# EAGLE design CH340C_USB-C_v1_complete (EAGLE 9.6.2)
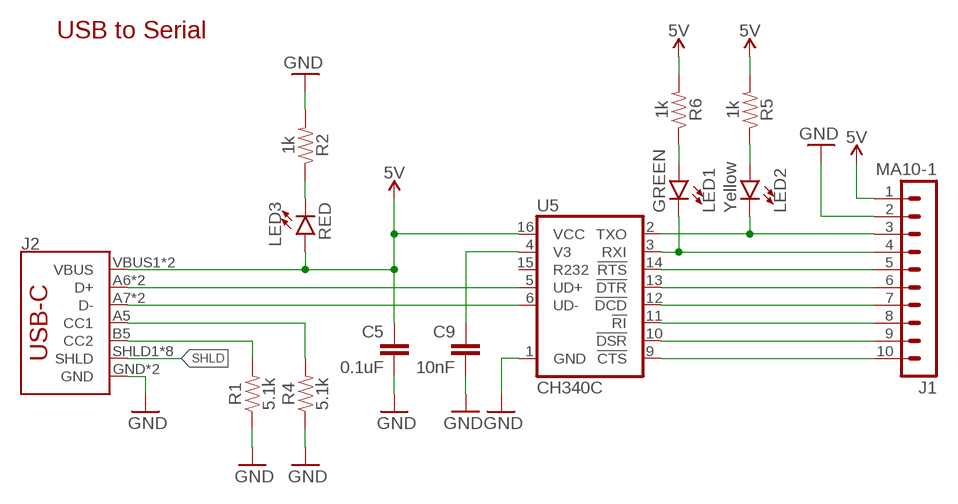
[diagram p0: schematic, sheet 1]

## Parts
C5  0.1uF  0.1UF-0603-25V-(+80/-20%)  [0603]
C9  10nF  10NF-0603-50V-10%  [0603]
J1  MA10-1  [MA10-1]
J2  USB_C16PIN  [USB-C-16P]
LED1  GREEN  LED-GREEN0603  [LED-0603]
LED2  Yellow  LED-YELLOW0603  [LED-0603]
LED3  RED  LED-GREEN0603  [LED-0603]
R1  5.1k  5.1KOHM5.1KOHM-0603-1/10W-1%  [0603]
R2  1k  1KOHM-0603-1/10W-1%  [0603]
R4  5.1k  5.1KOHM5.1KOHM-0603-1/10W-1%  [0603]
R5  1k  1KOHM-0603-1/10W-1%  [0603]
R6  1k  1KOHM-0603-1/10W-1%  [0603]
U5  CH340C  [SO016]

## Nets
5V: C5.1 J1.1 J2.VBUS1(VBUS) J2.VBUS2(VBUS) LED3.A R5.2 R6.2 U5.16(VCC)
!CTS: J1.10 U5.9(!CTS)
!DCD: J1.7 U5.12(!DCD)
!DSR: J1.9 U5.10(!DSR)
!DTR: J1.6 U5.13(!DTR)
!RI: J1.8 U5.11(!RI)
!RTS: J1.5 U5.14(!RTS)
CC1: J2.A5(CC1) R4.2
CC2: J2.B5(CC2) R1.2
D+: J2.A6(D+) J2.B6(D+) U5.5(UD+)
D-: J2.A7(D-) J2.B7(D-) U5.6(UD-)
GND [power]: C5.2 C9.2 J1.2 J2.GND J2.GND2(GND) R1.1 R2.2 R4.1 U5.1(GND)
N$1: LED3.C R2.1
N$10: LED1.A R6.1
N$11: LED2.A R5.1
RXI: J1.4 LED1.C U5.3(RXI)
SHLD: J2.SHLD1(SHLD) J2.SHLD2(SHLD) J2.SHLD3(SHLD) J2.SHLD4(SHLD) J2.SHLD5(SHLD) J2.SHLD6(SHLD) J2.SHLD7(SHLD) J2.SHLD8(SHLD)
TXO: J1.3 LED2.C U5.2(TXO)
V3: C9.1 U5.4(V3)
Unconnected: U5.15(R232)

## Notes on the sheet
- USB to Serial

## Library data of the parts
C5 = SparkFun-Capacitors:0.1UF: 0.1µF ceramic capacitors A capacitor is a passive two-terminal electrical component used to store electrical energy temporarily in an electric field.; PROD_ID: CAP-00810
C9 = SparkFun-Capacitors:10NF: 0.01uF/10nF/10,000pF ceramic capacitors A capacitor is a passive two-terminal electrical component used to store electrical energy temporarily in an electric field. CAP-09321; PROD_ID: CAP-00867
J1 = 00_marph_CON2:MA10-1: Pin Header
J2 = SparkFun-Connectors:USB_C: USB Type C 16Pin Connector Super Speed pins not available on the 16-pin purely SMD connector so this part is best for USB 2.0 implementations. D1 and D2 are tied together enabling D+/- no matter which way the cable is plugged into the connector. The two channel configuration pins (CC1/2) are exposed. These are normally connected to ground via 5.1k resistors but can be reconfigured for high current/high power applications.; PROD_ID: CONN-14122
LED1 = SparkFun-LED:LED-GREEN: Green SMD LED Used in manufacturing of various products at SparkFun Packages: 0603 - SMD 0603 package [Product Link] <http://www.futureelectronics.com/en/technologies/semiconductors/optoelectronics/leds/Pages/9894312-LTST-C190GKT.aspx?CrossPart=HSMG-C190&IM=0> LilyPad 1206 - SMD1206 LilyPad package [Product Link] <http://www.futureelectronics.com/en/Technologies/Product.aspx?ProductID=IN150NGHARVATEKCORPORATION2049943&IM=0> 1206 - SMD1206 package [Product Link] <http://www.futureelectronics.com/en/technologies/semiconductors/optoelectronics/leds/Pages/8315665-LTST-C150KGKT.aspx?IM=0> 1206 Bottom Mount -SMD 1206 Bottom Mount [Product Link] <http://www.digikey.com/product-detail/en/lite-on-inc/LTST-C230KGKT/160-1456-1-ND/386854> SparkFun Products: Pro Mini 328 -5V <https://www.sparkfun.com/products/821> RedBoard <https://www.sparkfun.com/products/12757> MP3 Trigger <https://www.sparkfun.com/products/13720> Makey Makey <https://www.sparkfun.com/products/11076>; PROD_ID: DIO-00821
LED2 = SparkFun-LED:LED-YELLOW: Yellow SMD LED Used in manufacturing several products at SparkFun. Packages: 0603 - SMD 0603 package[Product Link] <http://www.kingbrightusa.com/product.asp?catalog_name=LED&product_id=APT1608SYCK> 0603 -SMART - SMART SMD 0603 package (more efficient/more expensive) [Product Link] <http://www.osram-os.com/osram_os/en/products/product-catalog/led-light-emitting-diodes/smartled-0603/ly-l29k/index.jsp> LilyPad - SMD1206 package[Product Datasheet] <https://www.sparkfun.com/datasheets/DevTools/LilyPad/Q150YUS4.pdf> SparkFun Products: Blynk Board <https://www.sparkfun.com/products/13794> IOIO-OTG <https://www.sparkfun.com/products/13613> XBee Explorer Serial <https://www.sparkfun.com/products/13225>; PROD_ID: DIO-09003
LED3 = SparkFun-LED:LED-GREEN: Green SMD LED Used in manufacturing of various products at SparkFun Packages: 0603 - SMD 0603 package [Product Link] <http://www.futureelectronics.com/en/technologies/semiconductors/optoelectronics/leds/Pages/9894312-LTST-C190GKT.aspx?CrossPart=HSMG-C190&IM=0> LilyPad 1206 - SMD1206 LilyPad package [Product Link] <http://www.futureelectronics.com/en/Technologies/Product.aspx?ProductID=IN150NGHARVATEKCORPORATION2049943&IM=0> 1206 - SMD1206 package [Product Link] <http://www.futureelectronics.com/en/technologies/semiconductors/optoelectronics/leds/Pages/8315665-LTST-C150KGKT.aspx?IM=0> 1206 Bottom Mount -SMD 1206 Bottom Mount [Product Link] <http://www.digikey.com/product-detail/en/lite-on-inc/LTST-C230KGKT/160-1456-1-ND/386854> SparkFun Products: Pro Mini 328 -5V <https://www.sparkfun.com/products/821> RedBoard <https://www.sparkfun.com/products/12757> MP3 Trigger <https://www.sparkfun.com/products/13720> Makey Makey <https://www.sparkfun.com/products/11076>; PROD_ID: DIO-00821; VALUE: GREEN
R1 R4 = SparkFun-Resistors:5.1KOHM; PROD_ID: RES-12083
R2 R5 R6 = SparkFun-Resistors:1KOHM: 1kΩ resistor A resistor is a passive two-terminal electrical component that implements electrical resistance as a circuit element. Resistors act to reduce current flow, and, at the same time, act to lower voltage levels within circuits. - Wikipedia; PROD_ID: RES-07856
U5 = SparkFun-IC-Comms:CH340C; PROD_ID: IC-14038

## Net classes
1 power: width 0.178 mm

## Board
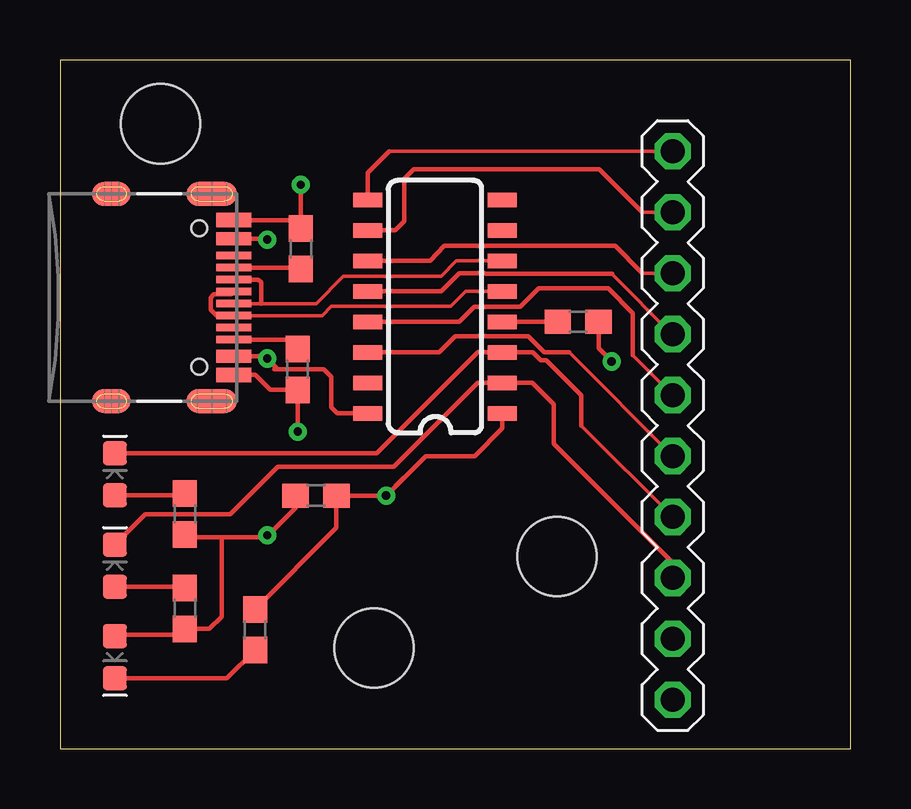
[diagram p1: board, top side]
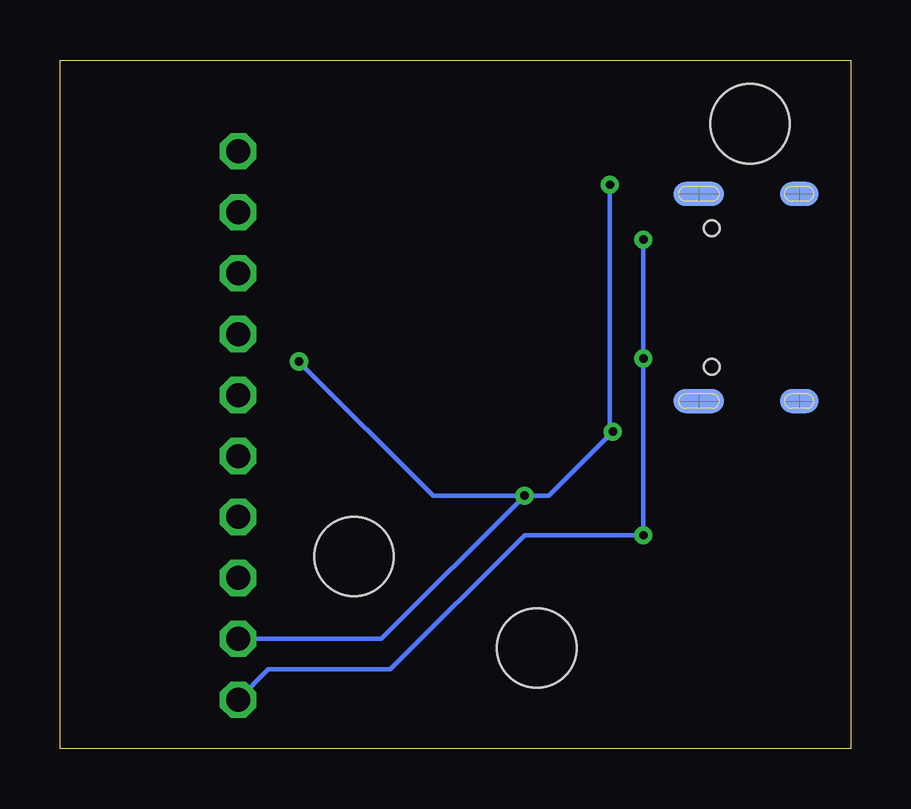
[diagram p2: board, bottom side, seen from below]

Size 32.94 x 28.69 mm. Coordinates in mm from the lower left corner, seen from the top.
Outline: 0,0 32.94,0 32.94,28.69 0,28.69 0,0
Copper layers (1*16): Top 0.035mm / dielectric 1.5mm / Bottom 0.035mm
Design rules "default": minimum track width 6mil, minimum drill 0.35mm, track to track 6mil, track to pad 6mil, pad to pad 6mil, via to via 6mil, smd to smd 6mil, copper to edge 40mil, drill to drill 6mil, minimum pad ring 10mil, minimum via ring 8mil, stop-mask expansion 4mil, vias tented up to drill 0mil, thermal gap 10mil
Holes 3.3 mm at 20.7,8 4.19,26.03 13.08,4.19

### Footprints (pad centres in the part's own frame; a part is rotated, then mirrored left to right if it is on the bottom)
0603 = smd 1.1 x 1: 1 -0.85,0; 2 0.85,0
MA10-1 = drill 1 octagon: 1 0,11.43; 2 0,8.89; 3 0,6.35; 4 0,3.81; 5 0,1.27; 6 0,-1.27; 7 0,-3.81; 8 0,-6.35; 9 0,-8.89; 10 0,-11.43
USB-C-16P = smd 0.3 x 1.45: A5 -1.25,0; A6 -0.25,0; A7 0.25,0; A8 1.25,0; B5 1.75,0; B6 0.75,0; B7 -0.75,0; B8 -1.75,0 | smd 0.6 x 1.45: GND -3.225,0; GND2 3.225,0 | smd 1 x 2.1: SHLD1 -4.32,-0.915; SHLD2 4.32,-0.915 | smd 1 x 2.1 bottom: SHLD3 -4.32,-0.915; SHLD4 4.32,-0.915 | smd 1 x 1.6: SHLD5 -4.32,-5.095; SHLD8 4.32,-5.095 | smd 1 x 1.6 bottom: SHLD6 -4.32,-5.095; SHLD7 4.32,-5.095 | smd 0.55 x 1.45: VBUS1 -2.45,0; VBUS2 2.45,0 | hole 0.65: -2.89,-1.445; 2.89,-1.445
LED-0603 = smd 1 x 1: A -0.877,0; C 0.877,0
SO016 = smd 0.6 x 1.2: 1 -4.445,-2.8; 2 -3.175,-2.8; 3 -1.905,-2.8; 4 -0.635,-2.8; 5 0.635,-2.8; 6 1.905,-2.8; 7 3.175,-2.8; 8 4.445,-2.8; 9 4.445,2.8; 10 3.175,2.8; 11 1.905,2.8; 12 0.635,2.8; 13 -0.635,2.8; 14 -1.905,2.8; 15 -3.175,2.8; 16 -4.445,2.8

### Placement (x,y rotation side)
C5  10.67,10.54 0 top
C9  21.59,17.78 0 top
J1  25.53,13.46 180 top
J2  7.24,18.8 270 top
LED1  2.29,11.43 90 top
LED2  2.29,7.62 90 top
LED3  2.29,3.81 270 top
R1  9.91,15.8 90 top
R2  8.13,4.95 90 top
R4  10.03,20.83 270 top
R5  5.21,5.84 270 top
R6  5.21,9.78 270 top
U5  15.62,18.42 90 top

### Tracks (layer width: path | path; a pad name or v marks a point on that pad's centre or on a via)
5V  (via drill 0.35)
  Top 0.178: 8.93,15.81 9.02,15.81 | 9.02,15.81 10.98,15.81 11.3,15.49 11.3,14.22 11.56,13.97 U5.16 | J2.VBUS1 8.6,21.25 v8.64,21.21 | J2.VBUS2 8.55,16.35 v8.64,16.26 9.02,15.88 9.02,15.81 | 6.73,8.8 6.73,5.5 6.22,4.99 R5.2 4.95,4.74 2.67,4.74 2.46,4.74 2.34,4.74 LED3.A | 6.73,8.8 5.33,8.8 R6.2 | C5.1 9.82,10.03 8.68,8.89 v8.64,8.89 8.55,8.8 6.73,8.8
  Bottom 0.178: v8.64,21.21 v8.64,16.26 v8.64,8.89 13.59,8.89 19.18,3.3 24.26,3.3 J1.1
!CTS
  Top 0.152: J1.10 13.71,24.89
  Top 0.178: U5.9 12.82,24 13.71,24.89
!DCD
  Top 0.152: J1.7 25.49,17.27 22.99,19.78
  Top 0.178: U5.12 15.88,19.05 16.64,19.81 17.69,19.81 17.72,19.78 22.99,19.78 23.02,19.78
!DSR
  Top 0.152: J1.9 24.26,22.35
  Top 0.178: U5.10 13.97,21.59 14.35,21.97 14.35,23.75 14.73,24.13 22.48,24.13 24.26,22.35
!DTR
  Top 0.152: J1.6 23.86,16.39
  Top 0.178: U5.13 16.63,17.78 17.27,18.42 19.18,18.42 19.94,19.18 22.84,19.18 23.86,18.15 23.86,16.39
!RI
  Top 0.152: J1.8 24.26,19.81
  Top 0.178: U5.11 15.43,20.32 16.01,20.95 23.14,20.95 24.23,19.84 24.26,19.81
!RTS
  Top 0.152: J1.5 21.21,16.51
  Top 0.178: U5.14 15.79,16.51 16.46,17.18 19.5,17.18 20.17,16.51 21.21,16.51
CC1
  Top 0.178: J2.A5 9.96,20.05 R4.2
CC2
  Top 0.178: J2.B5 9.46,17.05 R1.2
D+
  Top 0.152: J2.B6 10.92,18.05 11.3,18.43 16.27,18.43 16.9,19.05 U5.5
  Top 0.178: J2.A6 7.13,18.94 6.41,18.94 6.27,18.8 6.27,18.3 6.52,18.05 J2.B6
D-
  Top 0.152: J2.A7 8.38,18.55 10.67,18.55 11.81,19.69 15.88,19.69 16.52,20.32 U5.6
  Top 0.178: J2.B7 8.27,19.55 8.38,19.43 8.38,18.55
GND  (via drill 0.35)
  Top 0.178: J2.GND 9.69,22.02 R4.1 v10.03,23.5 | J2.GND2 8.13,15.57 8.75,14.95 R1.1 v9.91,13.21 9.91,13.92 | v13.59,10.54 C5.2 11.52,9.19 R2.2 | 14.35,11.3 v13.59,10.54 | U5.1 18.42,13.34 17.27,12.19 15.24,12.19 v13.59,10.54 | v22.99,16.13 22.44,16.68 C9.2
  Bottom 0.178: v13.59,10.54 12.57,10.54 9.97,13.14 | 9.97,13.14 v9.91,13.21 | v13.59,10.54 19.56,4.57 J1.2 | v22.99,16.13 17.4,10.54 v13.59,10.54 | v10.03,23.5 10.03,13.21 9.97,13.14
N$1
  Top 0.178: R2.1 6.96,2.93 LED3.C
N$10
  Top 0.178: R6.1 5.11,10.53 5.08,10.55 LED1.A
N$11
  Top 0.178: R5.1 5.21,6.74 LED2.A
RXI
  Top 0.152: J1.4 21.72,13.46
  Top 0.178: LED1.C 13.2,12.31 17.4,16.51 U5.3 19.7,16.51 20.03,16.18 20.27,16.18 21.72,14.73 21.72,13.46
TXO
  Top 0.152: J1.3 25.53,7.75
  Top 0.178: 25.53,7.75 20.57,12.7 20.57,14.35 19.68,15.24 U5.2 17.4,15.24 13.91,11.75 9.08,11.75 7.1,9.77 3.56,9.77 LED2.C
V3
  Top 0.178: U5.4 C9.1

### Text on the board
tValues: !CTS / !DSR / !RI / !DCD / !DTR / !RTS / RX / TX / GND / 5V | RX | TX | PWR